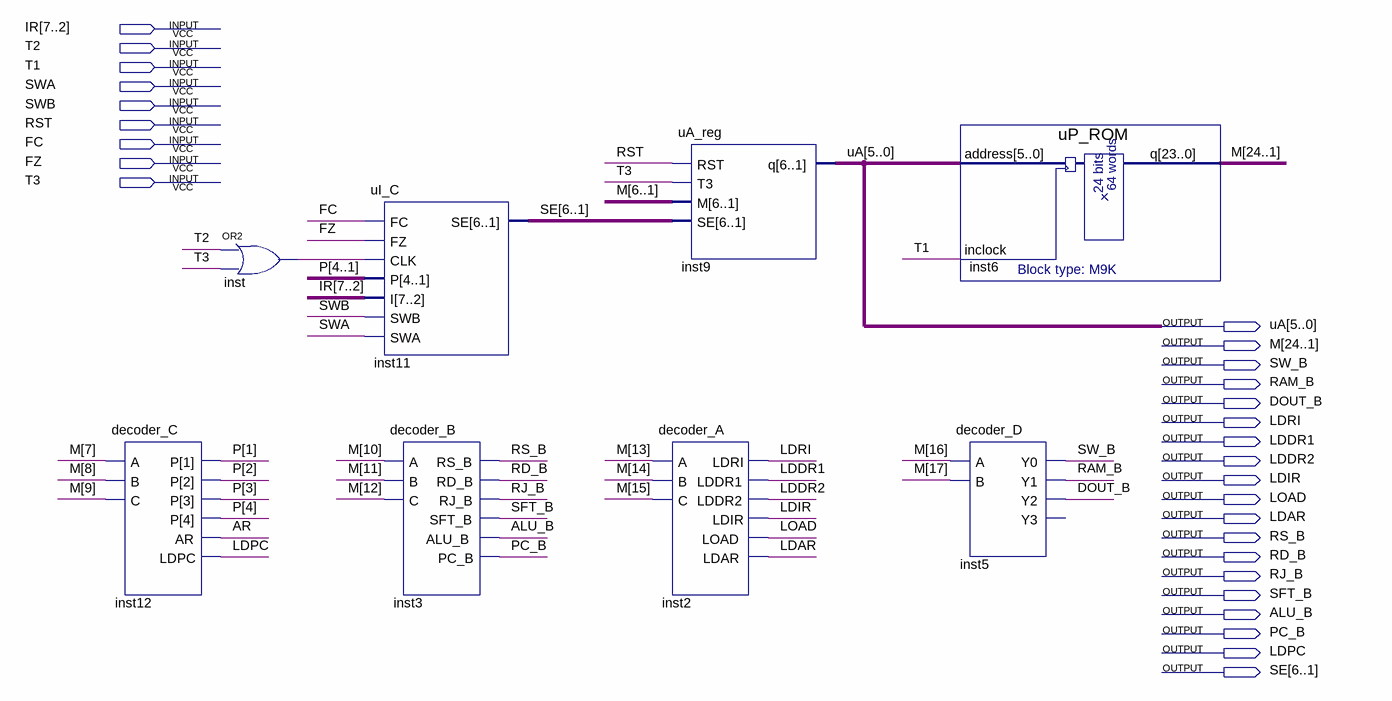
[diagram p0: schematic sheet]
// Quartus schematic uPC.bdf as structural Verilog: 8 symbols, 28 pins
module uPC (
  input  [7:2] IR,
  input  T2,
  input  T1,
  input  SWA,
  input  SWB,
  input  RST,
  input  FC,
  input  FZ,
  input  T3,
  output [5:0] uA,
  output [24:1] M,
  output SW_B,
  output RAM_B,
  output DOUT_B,
  output LDRI,
  output LDDR1,
  output LDDR2,
  output LDIR,
  output LOAD,
  output LDAR,
  output RS_B,
  output RD_B,
  output RJ_B,
  output SFT_B,
  output ALU_B,
  output PC_B,
  output LDPC,
  output [6:1] SE
);

  wire AR, inst_out;
  wire [4:1] P;

  decoder_C inst12 (.A(M[7]), .B(M[8]), .C(M[9]), .P(P), .AR(AR), .LDPC(LDPC));
  or inst (inst_out, T2, T3);
  uI_C inst11 (.FC(FC), .FZ(FZ), .CLK(inst_out), .P(P), .I(IR), .SWB(SWB), .SWA(SWA), .SE(SE));
  decoder_B inst3 (
    .A(M[10]), .B(M[11]), .C(M[12]), .RS_B(RS_B), .RD_B(RD_B), .RJ_B(RJ_B), .SFT_B(SFT_B), .ALU_B(ALU_B),
    .PC_B(PC_B));
  uA_reg inst9 (.RST(RST), .T3(T3), .M(M[6:1]), .SE(SE), .q(uA));
  decoder_A inst2 (
    .A(M[13]), .B(M[14]), .C(M[15]), .LDRI(LDRI), .LDDR1(LDDR1), .LDDR2(LDDR2), .LDIR(LDIR), .LOAD(LOAD),
    .LDAR(LDAR));
  uP_ROM inst6 (.address(uA), .inclock(T1), .q(M));
  decoder_D inst5 (.A(M[16]), .B(M[17]), .Y0(SW_B), .Y1(RAM_B), .Y2(DOUT_B));  // open: Y3
endmodule
